# EAGLE design Adafruit LED Sequin (EAGLE 6.3)
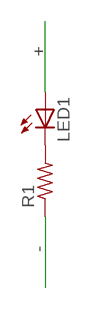
[diagram p0: schematic, sheet 1]

## Parts
LED1  LEDSMT1206  [1206]
R1  R-US_R0603  [R0603]

## Nets
+: LED1.A
-: R1.1
N$1: LED1.C R1.2

## Library data of the parts
LED1 = adafruit:LED: LED OSRAM: - CHIPLED LG R971, LG N971, LY N971, LG Q971, LY Q971, LO R971, LY R971 LH N974, LH R974 LS Q976, LO Q976, LY Q976 LO Q996 - Hyper CHIPLED LW Q18S LB Q993, LB Q99A, LB R99A - SideLED LS A670, LO A670, LY A670, LG A670, LP A670 LB A673, LV A673, LT A673, LW A673 LH A674 LY A675 LS A676, LA A676, LO A676, LY A676, LW A676 LS A679, LY A679, LG A679 - Hyper Micro SIDELED® LS Y876, LA Y876, LO Y876, LY Y876 LT Y87S - SmartLED LW L88C, LW L88S LB L89C, LB L89S, LG L890 LS L89K, LO L89K, LY L89K LS L896, LA L896, LO L896, LY L896 - TOPLED LS T670, LO T670, LY T670, LG T670, LP T670 LSG T670, LSP T670, LSY T670, LOP T670, LYG T670 LG T671, LOG T671, LSG T671 LB T673, LV T673, LT T673, LW T673 LH T674 LS T676, LA T676, LO T676, LY T676, LB T676, LH T676, LSB T676, LW T676 LB T67C, LV T67C, LT T67C, LS T67K, LO T67K, LY T67K, LW E67C LS E67B, LA E67B, LO E67B, LY E67B, LB E67C, LV E67C, LT E67C LW T67C LS T679, LY T679, LG T679 LS T770, LO T770, LY T770, LG T770, LP T770 LB T773, LV T773, LT T773, LW T773 LH T774 LS E675, LA E675, LY E675, LS T675 LS T776, LA T776, LO T776, LY T776, LB T776 LHGB T686 LT T68C, LB T68C - Hyper Mini TOPLED® LB M676 - Mini TOPLED Santana® LG M470 LS M47K, LO M47K, LY M47K Source: http://www.osram.convergy.de/
R1 = adafruit:R-US_: RESISTOR, American symbol

## Board
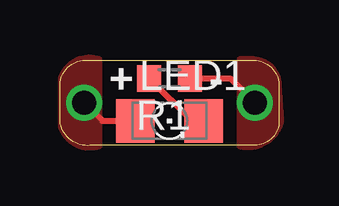
[diagram p1: board, top side]
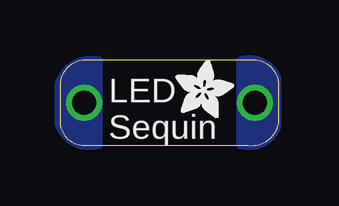
[diagram p2: board, bottom side, seen from below]

Size 9.14 x 3.56 mm. Coordinates in mm from the lower left corner, seen from the top.
Outline: 1.14,3.56 8,3.56 arc-90 9.14,2.55 9.14,1.02 arc-90 8.13,0.01 1.27,0.01 arc-90 0,1.02 0,2.55 arc-90 1.14,3.56
Copper layers (1*16): Top 0.035mm / dielectric 1.5mm / Bottom 0.035mm
Design rules "default *": minimum track width 10mil, minimum drill 14mil, track to track 10mil, track to pad 10mil, pad to pad 10mil, via to via 10mil, smd to smd 8mil, copper to edge 0mil, drill to drill 8mil, minimum pad ring 10mil, minimum via ring 8mil, stop-mask expansion 4mil, vias tented up to drill 0mil, thermal gap 10mil

### Footprints (pad centres in the part's own frame; a part is rotated, then mirrored left to right if it is on the bottom)
1206 = smd 1.6 x 1.803: A -1.422,0; C 1.422,0
R0603 = smd 1 x 1.1: 1 -0.85,0; 2 0.85,0

### Placement (x,y rotation side)
LED1  4.57,1.02 0 top
R1  4.57,2.8 180 top
U$1  [ADAFRUIT_2.5MM]  4.32,1.15 0 bottom

### Tracks (layer width: path | path; a pad name or v marks a point on that pad's centre or on a via)
+  (via drill 1)
  Top 0.254: v1.02,1.78 1.78,1.02 LED1.A
  pour Top: 1.65,3.59 arc90 0.03,2.78 0.03,0.82 arc90 1.65,-0.02
  pour Bottom: 1.65,3.59 arc90 0.03,2.78 0.03,0.82 arc90 1.65,-0.02
-  (via drill 1)
  Top 0.254: R1.1 7.11,2.8 v8.13,1.78
  pour Top: 7.49,-0.02 arc90 9.25,1.05 9.14,2.55 arc90 7.98,3.59 7.49,3.59
  pour Bottom: 7.49,-0.02 arc90 9.25,0.92 9.25,2.5 arc90 7.49,3.59
N$1
  Top 0.254: LED1.C 5.5,1.02 R1.2

### Text on the board
tPlace: + | -
bPlace: LED / Sequin